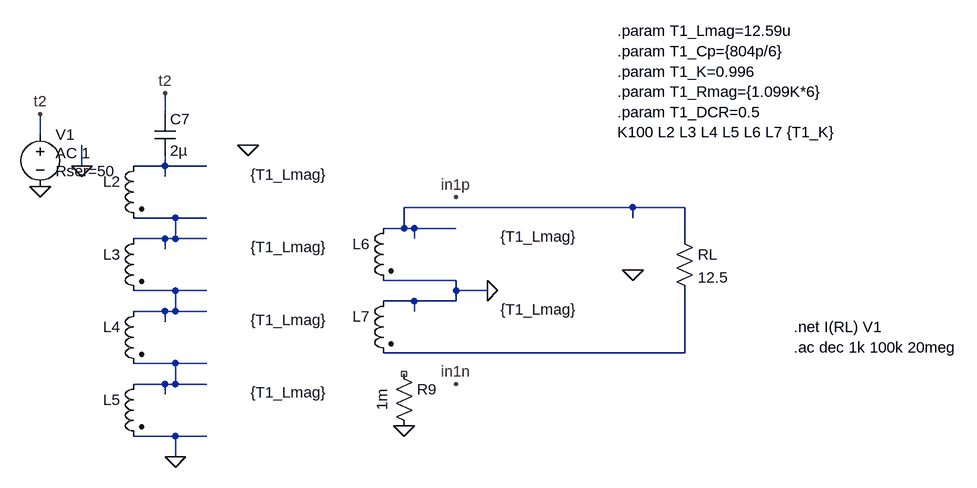
[diagram p0: schematic test_HP4_140L_model.asc]
test_HP4_140L_model.asc, the LTspice schematic file:
Version 4
SHEET 1 968 680
WIRE -320 -160 -320 -192
WIRE -512 -128 -512 -160
WIRE -448 -80 -448 -112
WIRE -320 -80 -320 -96
WIRE -320 -80 -368 -80
WIRE -256 -80 -320 -80
WIRE -320 -64 -320 -80
WIRE 400 -16 48 -16
WIRE 480 -16 400 -16
WIRE -304 0 -368 0
WIRE -256 0 -304 0
WIRE 400 0 400 -16
WIRE 48 16 48 -16
WIRE 48 16 16 16
WIRE 64 16 48 16
WIRE 128 16 64 16
WIRE -320 32 -368 32
WIRE -304 32 -304 0
WIRE -304 32 -320 32
WIRE -256 32 -304 32
WIRE 64 32 64 16
WIRE 480 32 480 -16
WIRE -320 48 -320 32
WIRE 128 96 16 96
WIRE -304 112 -368 112
WIRE -256 112 -304 112
WIRE 128 112 128 96
WIRE 176 112 128 112
WIRE 64 128 16 128
WIRE 128 128 128 112
WIRE 128 128 64 128
WIRE -320 144 -368 144
WIRE -304 144 -304 112
WIRE -304 144 -320 144
WIRE -256 144 -304 144
WIRE 64 144 64 128
WIRE -320 160 -320 144
WIRE 480 208 480 112
WIRE 480 208 16 208
WIRE -304 224 -368 224
WIRE -256 224 -304 224
WIRE -320 256 -368 256
WIRE -304 256 -304 224
WIRE -304 256 -320 256
WIRE -256 256 -304 256
WIRE -320 272 -320 256
WIRE -304 336 -368 336
WIRE -256 336 -304 336
WIRE -304 368 -304 336
FLAG -304 368 0
FLAG -512 -160 t2
FLAG 128 -32 in1p
FLAG 128 256 in1n
FLAG -448 -80 0
FLAG -512 -48 0
FLAG 400 80 0
FLAG -320 -192 t2
FLAG 48 320 0
FLAG -192 -112 0
FLAG 176 112 0
SYMBOL ind2 -352 -96 M0
WINDOW 3 -164 29 Right 2
SYMATTR Value {T1_Lmag}
SYMATTR InstName L2
SYMATTR Type ind
SYMATTR SpiceLine Rser={T1_DCR} Rpar={T1_Rmag} Cpar={T1_Cp}
SYMBOL ind2 -352 16 M0
WINDOW 3 -164 29 Right 2
SYMATTR Value {T1_Lmag}
SYMATTR InstName L3
SYMATTR Type ind
SYMATTR SpiceLine Rser={T1_DCR} Rpar={T1_Rmag} Cpar={T1_Cp}
SYMBOL ind2 -352 128 M0
WINDOW 3 -164 29 Right 2
SYMATTR Value {T1_Lmag}
SYMATTR InstName L4
SYMATTR Type ind
SYMATTR SpiceLine Rser={T1_DCR} Rpar={T1_Rmag} Cpar={T1_Cp}
SYMBOL ind2 -352 240 M0
WINDOW 3 -164 29 Right 2
SYMATTR Value {T1_Lmag}
SYMATTR InstName L5
SYMATTR Type ind
SYMATTR SpiceLine Rser={T1_DCR} Rpar={T1_Rmag} Cpar={T1_Cp}
SYMBOL ind2 32 0 M0
WINDOW 3 -164 29 Right 2
SYMATTR Value {T1_Lmag}
SYMATTR InstName L6
SYMATTR Type ind
SYMATTR SpiceLine Rser={T1_DCR} Rpar={T1_Rmag} Cpar={T1_Cp}
SYMBOL ind2 32 112 M0
WINDOW 3 -164 29 Right 2
SYMATTR Value {T1_Lmag}
SYMATTR InstName L7
SYMATTR Type ind
SYMATTR SpiceLine Rser={T1_DCR} Rpar={T1_Rmag} Cpar={T1_Cp}
SYMBOL voltage -512 -144 R0
WINDOW 123 24 44 Left 2
WINDOW 39 24 72 Left 2
SYMATTR InstName V1
SYMATTR Value ""
SYMATTR Value2 AC 1
SYMATTR SpiceLine Rser=50
SYMBOL res 464 16 R0
SYMATTR Value 12.5
SYMATTR InstName RL
SYMBOL res 32 224 R0
WINDOW 3 -18 39 VRight 2
SYMATTR Value 1m
SYMATTR InstName R9
SYMBOL cap -336 -160 R0
SYMATTR InstName C7
SYMATTR Value 2µ
TEXT 376 -288 Left 2 !.param T1_Lmag=12.59u\n.param T1_Cp={804p/6}\n.param T1_K=0.996\n.param T1_Rmag={1.099K*6}\n.param T1_DCR=0.5\nK100 L2 L3 L4 L5 L6 L7 {T1_K}
TEXT 648 168 Left 2 !.net I(RL) V1\n.ac dec 1k 100k 20meg

The netlist it stands for:
* test_HP4_140L_model.asc
L2 N001 N003 {T1_Lmag} Rser={T1_DCR} Rpar={T1_Rmag} Cpar={T1_Cp}
L3 N003 N004 {T1_Lmag} Rser={T1_DCR} Rpar={T1_Rmag} Cpar={T1_Cp}
L4 N004 N006 {T1_Lmag} Rser={T1_DCR} Rpar={T1_Rmag} Cpar={T1_Cp}
L5 N006 0 {T1_Lmag} Rser={T1_DCR} Rpar={T1_Rmag} Cpar={T1_Cp}
L6 N002 0 {T1_Lmag} Rser={T1_DCR} Rpar={T1_Rmag} Cpar={T1_Cp}
L7 0 N005 {T1_Lmag} Rser={T1_DCR} Rpar={T1_Rmag} Cpar={T1_Cp}
V1 t2 0 AC 1 Rser=50
RL N002 N005 12.5
R9 NC_01 0 1m
C7 t2 N001 2µ
.param T1_Lmag=12.59u
.param T1_Cp={804p/6}
.param T1_K=0.996
.param T1_Rmag={1.099K*6}
.param T1_DCR=0.5
K100 L2 L3 L4 L5 L6 L7 {T1_K}
.net I(RL) V1
.ac dec 1k 100k 20meg
.backanno
.end